# EAGLE design rpi-can-rs485 (EAGLE 6.5.0)
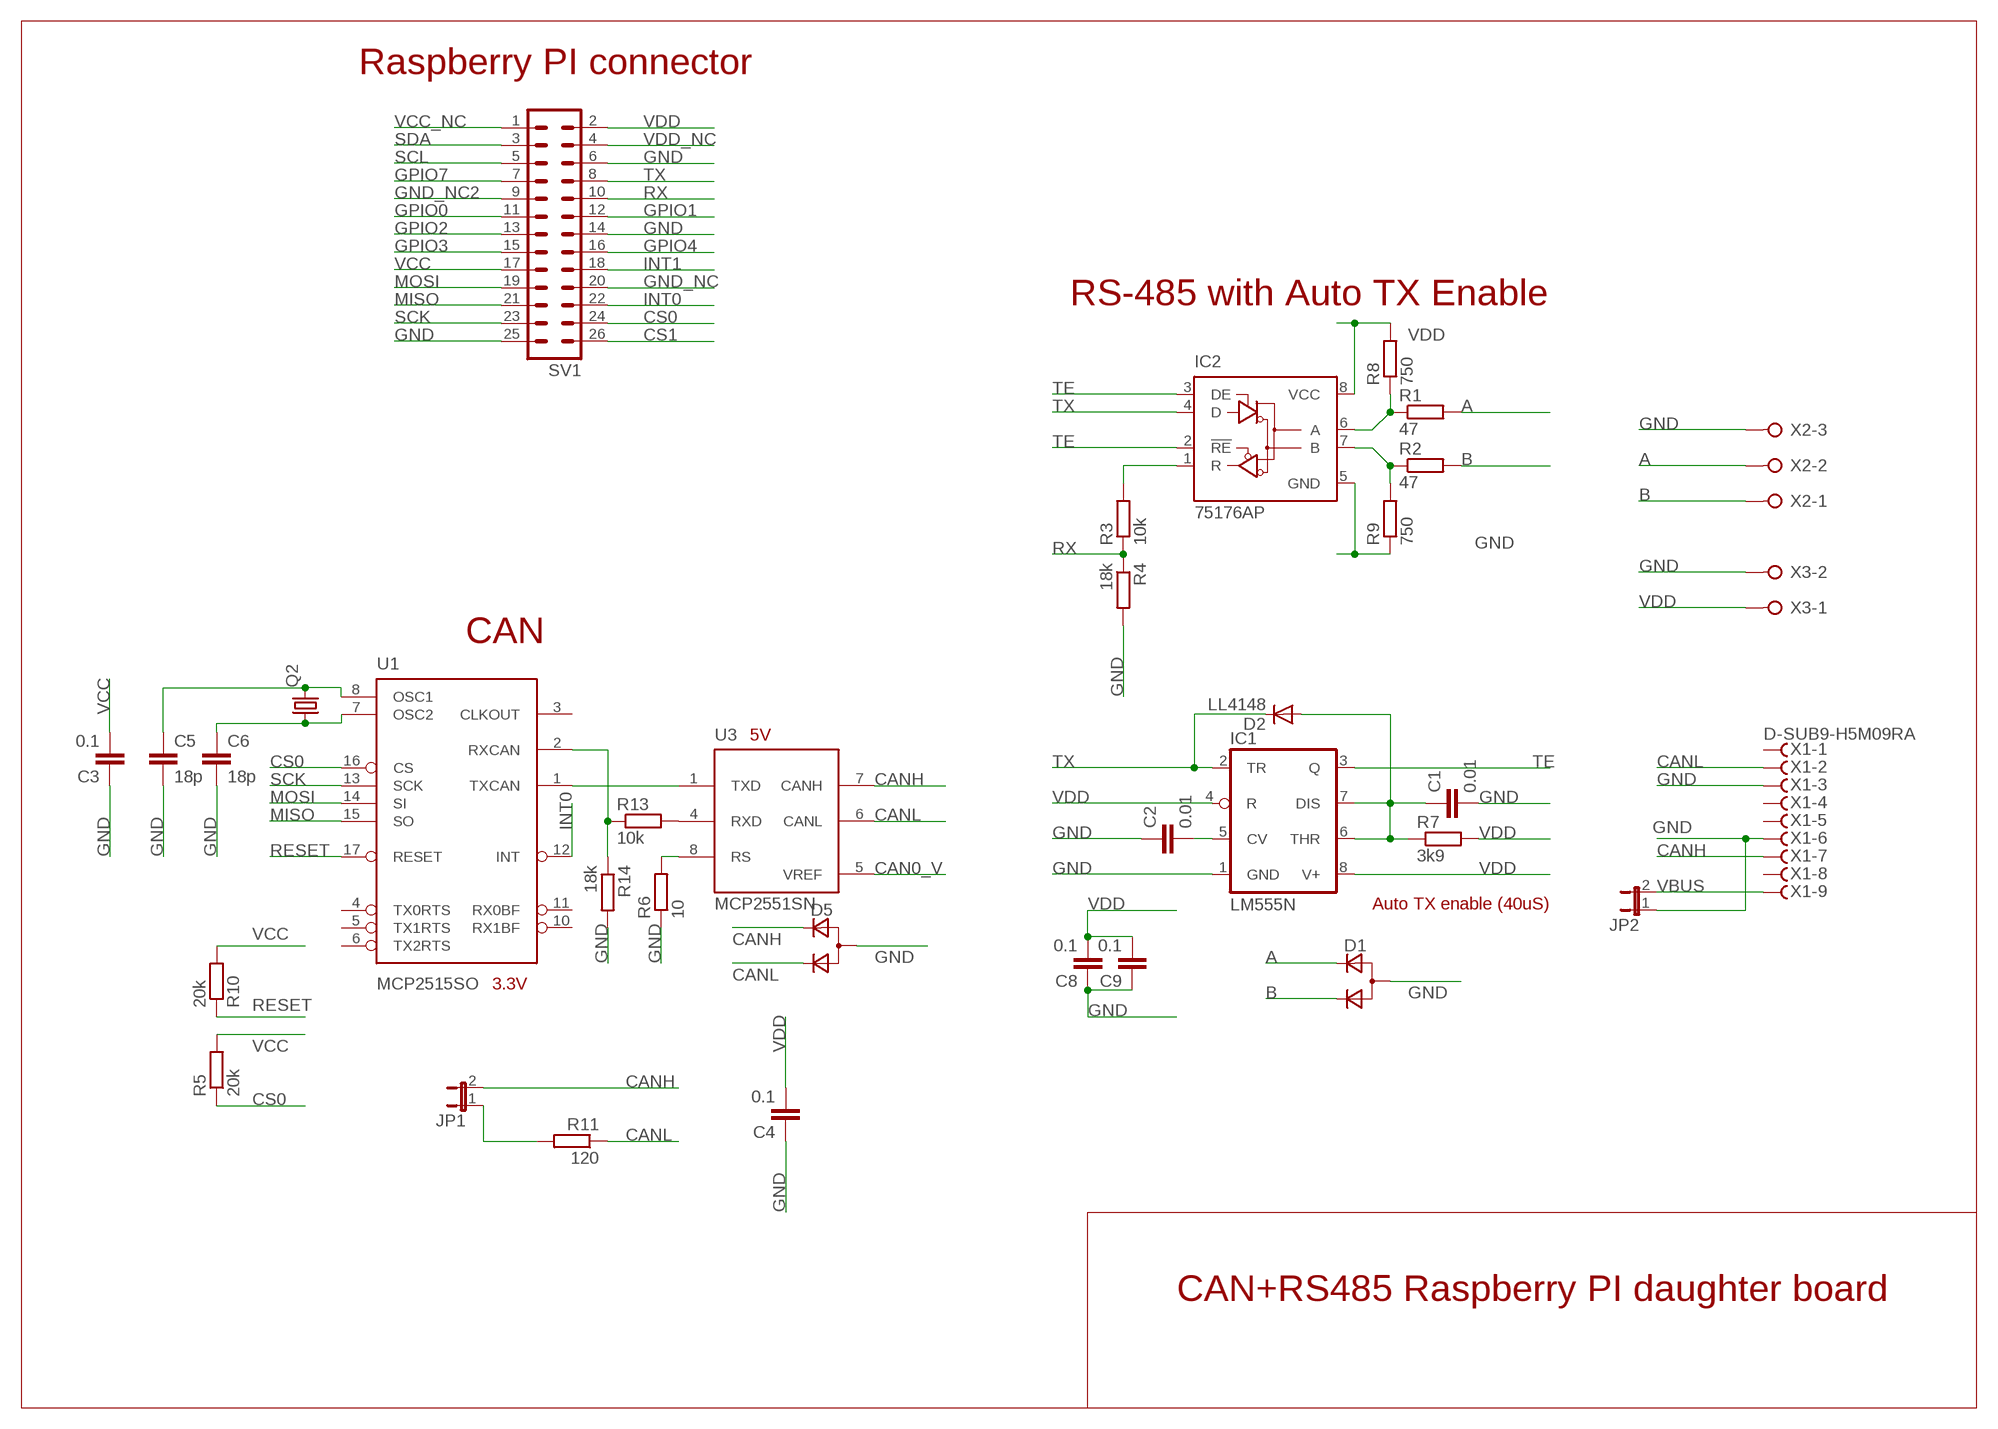
[diagram p0: schematic, sheet 1]

## Parts
C1  0.01  C-EUC0805  [C0805]
C2  0.01  C-EUC0805  [C0805]
C3  0.1  C-EUC0805  [C0805]
C4  0.1  C-EUC0805  [C0805]
C5  18p  C-EUC0805  [C0805]
C6  18p  C-EUC0805  [C0805]
C8  0.1  C-EUC0805  [C0805]
C9  0.1  C-EUC0805  [C0805]
D1  D_2CSOT323  [SOT323]
D2  LL4148  DIODE-SOD80C  [SOD80C]
D5  D_2CSOT323  [SOT323]
IC1  LM555N  [DIL08]
IC2  75176AP  [DIL08]
JP1  JP1E  [JP1]
JP2  JP1E  [JP1]
Q2  CRYSTALHC49S  [HC49/S]
R1  47  R-EU_R1206  [R1206]
R2  47  R-EU_R1206  [R1206]
R3  10k  R-EU_R0805  [R0805]
R4  18k  R-EU_R0805  [R0805]
R5  20k  R-EU_R0603  [R0603]
R6  10  R-EU_R0805  [R0805]
R7  3k9  R-EU_R0805  [R0805]
R8  750  R-EU_R1206  [R1206]
R9  750  R-EU_R1206  [R1206]
R10  20k  R-EU_R0805  [R0805]
R11  120  R-EU_R0805  [R0805]
R13  10k  R-EU_R0805  [R0805]
R14  18k  R-EU_R0805  [R0805]
SV1  MA13-2  [MA13-2]
U1  MCP2515SO  MCP2510SO  [SO-18W]
U3  MCP2551SN  [SO-08]
X1  D-SUB9-H5M09RA  [H5M09RA]
X2  W237-03P  [W237-133]
X3  W237-02P  [W237-132]

## Nets
A: D1.2(C1) R1.2 X2.2
B: D1.3(C2) R2.2 X2.1
CAN0_TX: U1.1(TXCAN) U3.1(TXD)
CAN0_V: U3.5(VREF)
CANH: D5.2(C1) JP1.2 U3.7(CANH) X1.7
CANL: D5.3(C2) R11.1 U3.6(CANL) X1.2
CS0: R5.1 SV1.24 U1.16(CS)
CS1: SV1.26
GND: C1.2 C2.1 C3.1 C4.1 C5.2 C6.2 C8.1 C9.1 D1.1(A) D5.1(A) IC1.1(GND) IC2.5(GND) JP2.1 R4.2 R6.1 R9.1 R14.2 SV1.6 SV1.14 SV1.25 X1.3 X1.6 X2.3 X3.2
GND_NC: SV1.20
GND_NC2: SV1.9
GPIO0: SV1.11
GPIO1: SV1.12
GPIO2: SV1.13
GPIO3: SV1.15
GPIO4: SV1.16
GPIO7: SV1.7
INT0: SV1.22 U1.12(INT)
INT1: SV1.18
MISO: SV1.21 U1.15(SO)
MOSI: SV1.19 U1.14(SI)
N$1: C6.1 Q2.1 U1.7(OSC2)
N$2: C1.1 D2.A IC1.6(THR) IC1.7(DIS) R7.1
N$3: IC2.7(B) R2.1 R9.2
N$4: IC2.6(A) R1.1 R8.1
N$5: C2.2 IC1.5(CV)
N$6: C5.1 Q2.2 U1.8(OSC1)
N$7: R6.2 U3.8(RS)
N$8: IC2.1(R) R3.2
N$9: JP1.1 R11.2
N$10: R13.2 U3.4(RXD)
N$13: R13.1 R14.1 U1.2(RXCAN)
RESET: R10.1 U1.17(RESET)
RX: R3.1 R4.1 SV1.10
SCK: SV1.23 U1.13(SCK)
SCL: SV1.5
SDA: SV1.3
TE: IC1.3(Q) IC2.2(!RE) IC2.3(DE)
TX: D2.C IC1.2(TR) IC2.4(D) SV1.8
VBUS: JP2.2 X1.9
VCC: C3.2 R5.2 R10.2 SV1.17
VCC_NC: SV1.1
VDD: C4.2 C8.2 C9.2 IC1.4(R) IC1.8(V+) IC2.8(VCC) R7.2 R8.2 SV1.2 X3.1
VDD_NC: SV1.4
Unconnected: U1.3(CLKOUT) U1.4(TX0RTS) U1.5(TX1RTS) U1.6(TX2RTS) U1.10(RX1BF) U1.11(RX0BF) X1.1 X1.4 X1.5 X1.8

## Notes on the sheet
- Raspberry PI connector
- RS-485 with Auto TX Enable
- CAN
- 5V
- Auto TX enable (40uS)
- 3.3V
- CAN+RS485 Raspberry PI daughter board

## Power pins joined to a net without a drawn wire
GND: U1.9(VSS) U3.2(VSS)
VCC: U1.18(VDD)
VDD: U3.3(VDD)

## Library data of the parts
C1-C6 C8 C9 = rcl:C-EU: CAPACITOR, European symbol
D1 D5 = zetex:D_2C: Dual DIODE; OC_FARNELL: unknown; OC_NEWARK: unknown
D2 = diode:DIODE-: DIODE
IC1 = linear:*555: TIMER
IC2 = 751xx:75176A: DIFFERENTIAL BUS TRANSCEIVER Source: http://focus.ti.com/lit/ds/symlink/sn75176a.pdf
JP1 JP2 = jumper:JP1E: JUMPER
Q2 = crystal:CRYSTAL: CRYSTAL; OC_FARNELL: 1667008; OC_NEWARK: unknown
R1-R11 R13 R14 = rcl:R-EU_: RESISTOR, European symbol
SV1 = con-lstb:MA13-2: PIN HEADER; OC_FARNELL: unknown; OC_NEWARK: unknown
U1 = my-microchip-can:MCP2510
U3 = my-microchip-can:MCP2551: High Speed CAN tranceiver
X1 = con-thomas-betts:D-SUB9-: D-Subminiatur Connector Source: Electronioc Interconnects European Edition 1998; OC_FARNELL: unknown; OC_NEWARK: unknown
X2 = con-wago-508:W237-03P: WAGO SREW CLAMP; OC_FARNELL: unknown; OC_NEWARK: unknown
X3 = con-wago-508:W237-02P: WAGO SREW CLAMP; OC_FARNELL: unknown; OC_NEWARK: unknown

## Board
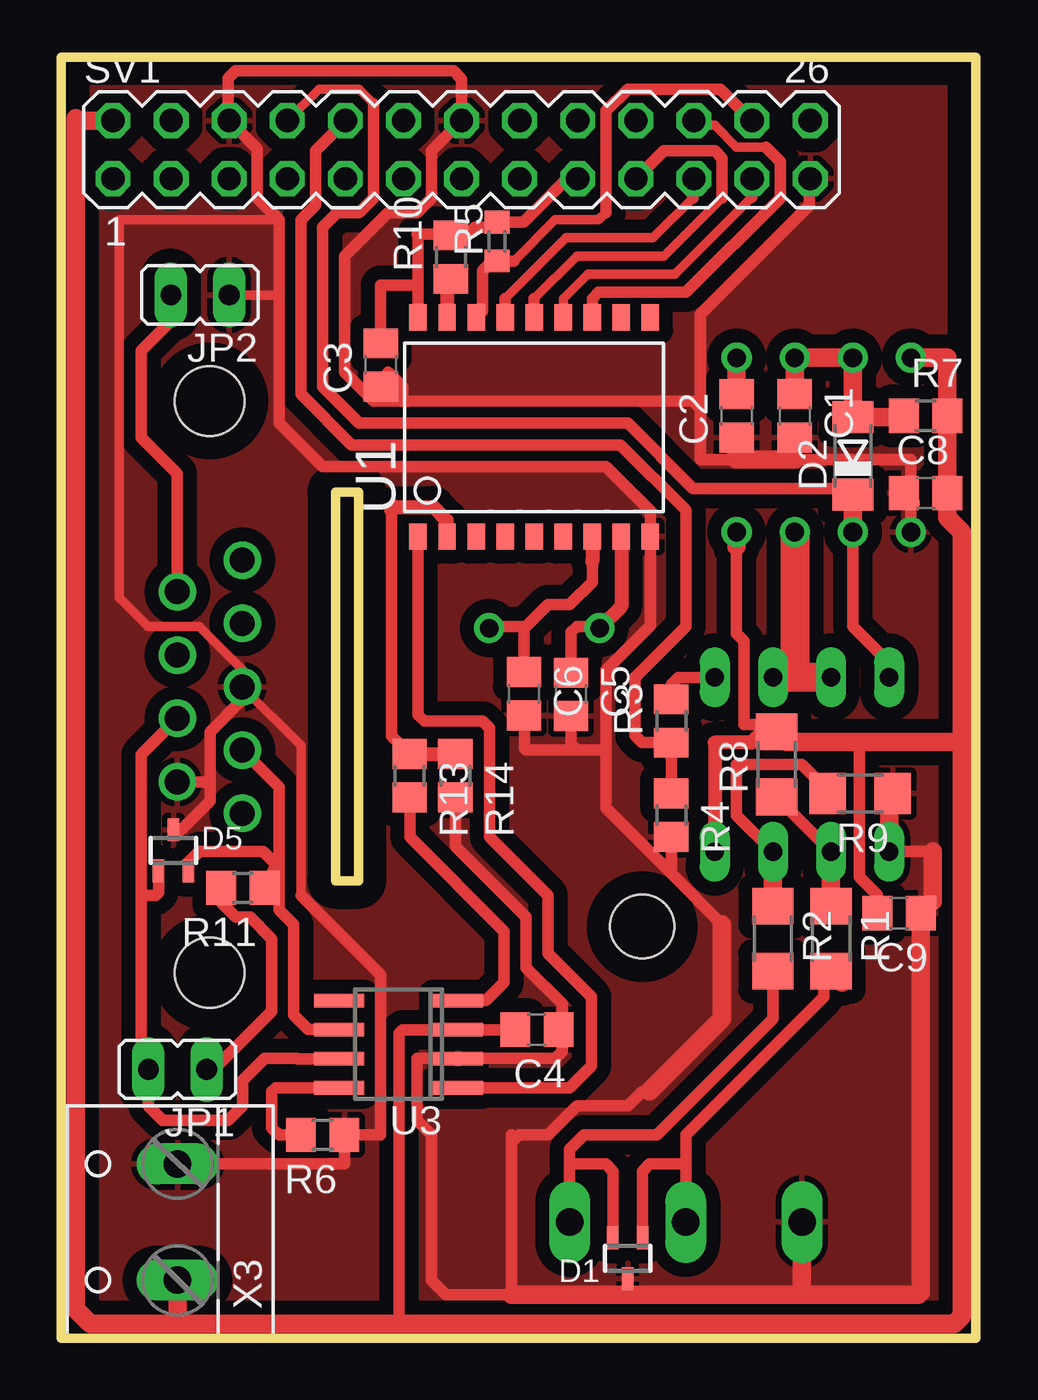
[diagram p1: board, top side]
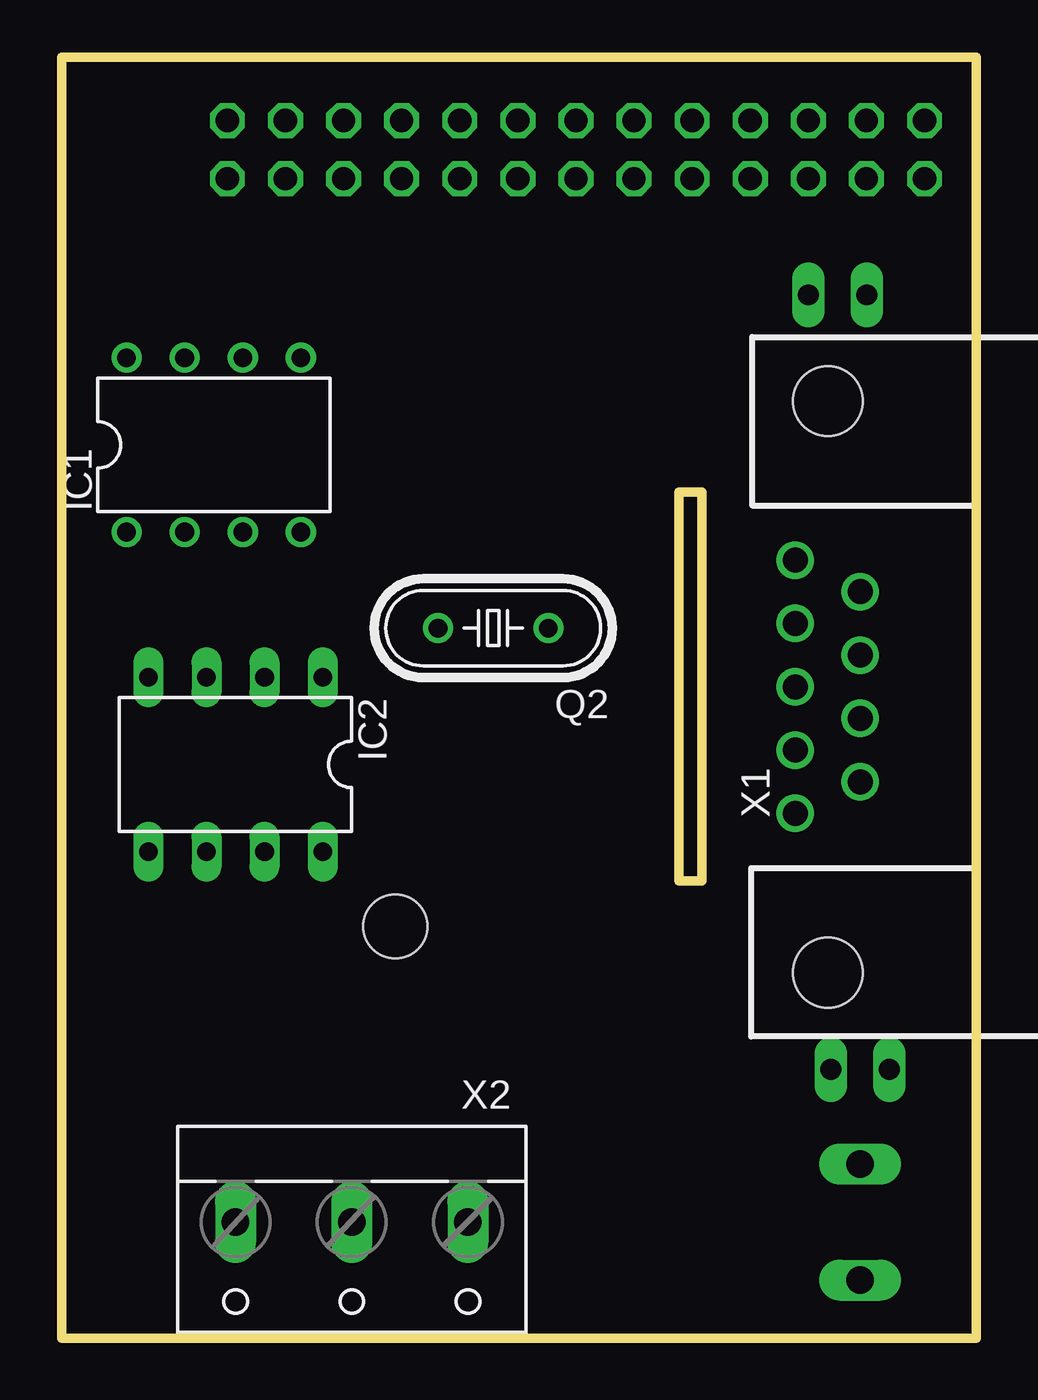
[diagram p2: board, bottom side, seen from below]

Size 40 x 56 mm. Coordinates in mm from the lower left corner, seen from the top.
Outline: 0,0 40,0 40,56 0,56 0,0
Outline: 12,20 13,20 13,37 12,37 12,20
Copper layers (1*16): Top 0.035mm / dielectric 1.5mm / Bottom 0.035mm
Design rules: minimum track width 10mil, minimum drill 24mil, track to track 8mil, track to pad 8mil, pad to pad 8mil, via to via 8mil, smd to smd 8mil, copper to edge 40mil, drill to drill 8mil, minimum pad ring 10mil, minimum via ring 8mil, stop-mask expansion 4mil, vias tented up to drill 0mil, thermal gap 10mil
Holes 2.8 mm at 25.4,18

### Footprints (pad centres in the part's own frame; a part is rotated, then mirrored left to right if it is on the bottom)
C0805 = smd 1.3 x 1.5: 1 -0.95,0; 2 0.95,0
SOT323 = smd 0.5 x 1: 1 0,0.9; 2 -0.65,-0.9; 3 0.65,-0.9
SOD80C = smd 1.4 x 1.8: A 1.7,0; C -1.7,0
DIL08 = drill 0.813 pad 1.27: 1 -3.81,-3.81; 2 -1.27,-3.81; 3 1.27,-3.81; 4 3.81,-3.81; 5 3.81,3.81; 6 1.27,3.81; 7 -1.27,3.81; 8 -3.81,3.81
DIL08' = drill 0.813 long: 1 -3.81,-3.81; 2 -1.27,-3.81; 3 1.27,-3.81; 4 3.81,-3.81; 5 3.81,3.81; 6 1.27,3.81; 7 -1.27,3.81; 8 -3.81,3.81
JP1 = drill 0.914 long: 1 0,-1.27; 2 0,1.27
HC49/S = drill 0.813: 1 -2.413,0; 2 2.413,0
R1206 = smd 1.6 x 1.803: 1 -1.422,0; 2 1.422,0
R0805 = smd 1.3 x 1.5: 1 -0.95,0; 2 0.95,0
R0603 = smd 1 x 1.1: 1 -0.85,0; 2 0.85,0
MA13-2 = drill 1.016 octagon: 1 -15.24,-1.27; 2 -15.24,1.27; 3 -12.7,-1.27; 4 -12.7,1.27; 5 -10.16,-1.27; 6 -10.16,1.27; 7 -7.62,-1.27; 8 -7.62,1.27; 9 -5.08,-1.27; 10 -5.08,1.27; 11 -2.54,-1.27; 12 -2.54,1.27; 13 0,-1.27; 14 0,1.27; 15 2.54,-1.27; 16 2.54,1.27; 17 5.08,-1.27; 18 5.08,1.27; 19 7.62,-1.27; 20 7.62,1.27; 21 10.16,-1.27; 22 10.16,1.27; 23 12.7,-1.27; 24 12.7,1.27; 25 15.24,-1.27; 26 15.24,1.27
SO-18W = smd 0.762 x 1.143: 1 -5.08,-4.788; 2 -3.81,-4.788; 3 -2.54,-4.788; 4 -1.27,-4.788; 5 0,-4.788; 6 1.27,-4.788; 7 2.54,-4.788; 8 3.81,-4.788; 9 5.08,-4.788; 10 5.08,4.788; 11 3.81,4.788; 12 2.54,4.788; 13 1.27,4.788; 14 0,4.788; 15 -1.27,4.788; 16 -2.54,4.788; 17 -3.81,4.788; 18 -5.08,4.788
SO-08 = smd 0.6 x 2.2: 1 -1.905,-2.6; 2 -0.635,-2.6; 3 0.635,-2.6; 4 1.905,-2.6; 5 1.905,2.6; 6 0.635,2.6; 7 -0.635,2.6; 8 -1.905,2.6
H5M09RA = drill 1.092: 1 -5.537,1.422; 2 -2.769,1.422; 3 0,1.422; 4 2.769,1.422; 5 5.537,1.422; 6 -4.153,-1.422; 7 -1.384,-1.422; 8 1.384,-1.422; 9 4.153,-1.422 | hole 3.048: -12.497,0; 12.497,0
W237-133 = drill 1.194 long: 1 -5.08,-0.635; 2 0,-0.635; 3 5.08,-0.635
W237-132 = drill 1.194 long: 1 -2.54,-0.635; 2 2.54,-0.635

### Placement (x,y rotation side)
C1  32.08,40.32 270 top
C2  29.53,40.32 90 top
C3  13.98,42.55 90 top
C4  20.8,13.49 180 top
C5  22.3,28.15 270 top
C6  20.24,28.17 270 top
C8  37.79,36.94 0 top
C9  36.63,18.58 180 top
D1  24.77,3.49 180 top
D2  34.61,38.58 90 top
D5  4.91,21.33 0 top
IC1  33.34,39.05 0 bottom
IC2  75176AP  [DIL08']  32.39,25.08 180 bottom
JP1  5.09,11.75 90 top
JP2  6.07,45.61 90 top
Q2  21.13,31.04 180 bottom
R1  33.66,17.46 270 top
R2  31.12,17.46 270 top
R3  26.68,26.99 90 top
R4  26.68,22.86 270 top
R5  19.06,47.94 90 top
R6  11.44,8.89 180 top
R7  37.79,40.32 0 top
R8  31.28,25.08 90 top
R9  34.93,23.81 180 top
R10  17.04,47.26 90 top
R11  7.94,19.68 180 top
R13  15.23,24.59 270 top
R14  17.24,24.59 270 top
SV1  17.51,51.96 0 top
U1  20.69,39.84 0 top
U3  14.75,12.86 90 top
X1  6.5,28.48 90 bottom
X2  27.31,4.45 180 bottom
X3  4.45,5.08 90 top

### Tracks (layer width: path | path; a pad name or v marks a point on that pad's centre or on a via)
A
  Top 0.508: X2.2 27.31,7.62 | 27.31,7.62 27.31,8.89 33.34,14.92 33.34,15.72 R1.2 | D1.2 25.41,4.41 25.41,7.3 25.72,7.62 27.31,7.62
  Top 0.813: R1.2 34.14,15.56
B
  Top 0.508: R2.2 31.12,13.97 26.04,8.89 22.87,8.89 22.23,8.26 22.23,7.62 | D1.3 24.14,4.41 24.14,7.3 23.82,7.62 22.23,7.62 | 22.23,7.62 X2.1
CAN0_TX
  Top 0.508: U1.1 15.62,27.25 15.88,26.99 18.42,26.99 18.74,26.67 18.74,21.91 21.28,19.37 21.28,16.83 23.19,14.92 23.19,11.91 22.23,10.95 U3.1
  Top 0.61: U1.1
CANH
  Top 0.508: 3.5,19.37 3.5,25.52 X1.7 | 3.5,19.37 3.5,12.06 JP1.2 3.82,10.16 4.45,9.53 7.31,9.53 7.94,10.16 7.94,11.27 8.9,12.22 10.32,12.22 U3.7 | D5.2 4.26,19.5 4.14,19.37 3.5,19.37
CANL
  Top 0.508: X1.2 9.53,24.1 9.53,20.96 | 9.53,20.96 9.4,20.7 | 9.4,20.7 R11.1 | 9.53,20.96 9.53,18.73 10.17,18.1 10.17,14.13 10.8,13.49 U3.6 | D5.3 5.56,20.8 6.04,21.27 8.83,21.27 9.4,20.7
CS0
  Top 0.406: 23.82,49.21 23.5,48.9 21.6,48.9 19.8,47.09
  Top 0.508: SV1.24 28.83,54.61 24.77,54.61 23.82,53.66 23.82,49.21 | U1.16 18.42,44.9 18.42,46.67 18.84,47.09 R5.1 19.8,47.09
  Top 0.61: 18.11,44.66 U1.16
GND
  Top 0.406: 10.48,19.37 10.48,25.92 X1.3 7.92,29.23 6.04,31.11 3.82,31.11 2.55,32.38 2.55,48.9 9.53,48.9 | JP2.1 9.53,45.61 9.53,45.72
  Top 0.508: IC1.1 37.16,36.51 37.16,38.42 32.08,38.42 C1.2 | 29.53,38.42 27.95,38.42 27.95,40.64 | 14.93,40.96 13.66,40.96 12.39,42.23 12.39,47.31 14.3,49.21 15.56,49.21 16.2,49.85 16.2,51.92 SV1.14 17.51,55.05 17.15,55.4 7.63,55.4 7.31,55.09 7.31,53.27 SV1.6 8.58,52 8.58,49.85 9.53,48.9 9.53,45.72 9.53,40.01 11.44,38.1 23.82,38.1 25.77,36.16 U1.9 25.77,31.16 23.82,29.21 23.82,25.72 | IC2.5 38.11,21.27 | 37.58,2.02 37.47,1.91 | 32.39,2.22 32.08,1.91 | R14.2 17.24,21.5 20.33,18.41 20.33,16.19 21.92,14.61 21.92,13.65 C4.1 21.91,13.34 21.92,13.34 21.92,12.54 21.6,12.22 U3.2 | 22.41,27.3 C5.2 22.3,25.97 22.55,25.72 | C6.2 20.26,27.2 20.26,25.78 20.33,25.72 22.55,25.72 | 23.82,25.72 23.82,23.18 26.68,20.32 | 26.68,20.32 28.9,18.1 | R4.2 26.68,20.32 | C3.1 14.29,42.23 14.93,41.59 14.93,40.96 | 27.95,40.64 27.95,44.77 32.71,49.53 32.71,50.65 SV1.25 | 14.93,40.96 27.63,40.96 27.95,40.64 | 19.69,8.89 19.69,8.57 | 19.69,8.57 19.69,1.91 16.83,1.91 16.2,2.54 16.2,8.89 15.56,9.53 15.56,12.22 U3.2 | 22.55,25.72 23.82,25.72 | 38.11,19.1 C9.1 | D1.1 24.77,1.91 | 25.72,10.79 25.41,10.79 24.77,10.16 22.55,10.16 21.28,8.89 20.01,8.89 19.69,8.57 | 10.48,19.37 13.98,15.88 13.98,8.89 R6.1 12.39,7.62 X3.2 | U3.2 | D5.1 5.25,22.23 6.52,23.5 6.52,24.13 | 6.52,24.13 6.52,26.51 7.94,27.94 7.94,28.46 X1.3 | X1.6 6.32,24.32 6.52,24.13
  Top 0.813: IC2.5 36.2,23.66 R9.1 | 38.11,19.1 38.11,21.27 | 32.08,38.42 29.53,38.42 C2.1 | 36.84,36.83 37.16,36.51 | C9.1 37.58,2.02 | 37.47,1.91 32.08,1.91 24.77,1.91 19.69,1.91 | X2.3 32.39,2.22 | 25.72,10.79 28.9,13.97 28.9,18.1
  pour Top (isolate 0.61): 0.01,0 40.01,0 40.01,55.88 0.01,55.88
INT0
  Top 0.406: 30.81,52.07 29.53,52.07 28.58,53.02 27.88,53.02 SV1.22
  Top 0.508: 30.81,52.07 31.44,51.44 31.44,49.85 27.31,45.72 23.5,45.72 23.22,45.44 U1.12
MISO
  Top 0.406: 19.42,45.44 22.07,48.1 25.88,48.1 27.63,49.85
  Top 0.508: U1.15 19.42,45.44 | 27.63,49.85 27.63,50.65 SV1.21
MOSI
  Top 0.406: 28.9,49.85 26.36,47.31 22.55,47.31 20.69,45.44
  Top 0.508: SV1.19 26.35,51.91 28.58,51.91 28.9,51.59 28.9,49.85 | U1.14 20.69,45.44
N$1
  Top 0.508: C6.1 20.24,31.03 20.33,31.11 | 20.33,31.11 18.79,31.11 Q2.1 | 23.22,33.96 23.22,33.06 22.23,32.07 21.28,32.07 20.33,31.11
  Top 0.61: U1.7 23.22,33.96
N$2
  Top 0.813: C1.1 IC1.6 IC1.7 D2.A 36.79,40.28 R7.1
N$3
  Top 0.508: 33.51,23.96 32.39,25.08 29.53,25.08 29.53,22.86 IC2.7
  Top 0.813: R9.2 33.51,23.96 | IC2.7 R2.1
N$4
  Top 0.508: R8.1 IC2.6
  Top 0.813: R8.1 | IC2.6 R1.1
N$5
  Top 0.813: C2.2 IC1.5
N$6
  Top 0.508: C5.1 22.3,30.86 22.55,31.11 23.47,31.11 Q2.2
  Top 0.61: U1.8 24.5,31.99 Q2.2
N$7
  Top 0.508: U3.8 9.37,10.95 9.22,10.79 9.22,9.21 9.53,8.89 R6.2
N$8
  Top 0.508: IC2.1 27,28.89 26.68,28.57 R3.2
N$9
  Top 0.508: R11.2 7,19.05 7.63,18.41 8.26,18.41 9.22,17.46 9.22,14.29 6.67,11.75 JP1.1
N$10
  Top 0.508: U3.4 18.58,14.76 19.38,15.56 19.38,17.78 15.25,21.91 15.25,23.62 R13.2
  Top 0.61: R13.2 15.09,23.5
N$13
  Top 0.508: 14.45,36.19 14.45,26.32 R13.1
  Top 0.61: 14.45,36.19 14.6,36.34 16.28,36.34 16.86,35.75 16.86,35.06 U1.2 | R13.1 R14.1
RESET
  Top 0.61: R10.1 16.88,45.93 U1.17
RX
  Top 0.508: SV1.10 11.12,51.92 11.12,49.53 10.48,48.9 10.48,41.27 12.71,39.05 24.45,39.05 27.31,36.2 27.31,31.11 25.09,28.89 25.09,26.35 25.41,26.04 R3.1 R4.1
SCK
  Top 0.406: U1.13 21.95,45.44 23.03,46.51 26.84,46.51 30.21,49.89 | 30.17,50.65 SV1.23
  Top 0.508: 30.21,49.89 SV1.23
TE
  Top 1.27: IC2.3 32.08,28.89 | 32.08,28.89 IC2.2 | IC1.3 32.08,28.89
TX
  Top 0.406: 13.66,53.98 13.03,54.61 11.27,54.61 SV1.8
  Top 0.508: 34.41,37.15 27.63,37.15 24.77,40.01 13.03,40.01 11.44,41.59 11.44,48.58 12.07,49.21 13.03,49.21 13.66,49.85 13.66,53.98 | IC2.4 36.2,29.53 34.61,31.11 IC1.2
  Top 0.813: 34.41,37.15 D2.C IC1.2
VBUS
  Top 0.508: X1.9 5.08,37.79 3.5,39.37 3.5,43.18 4.77,44.45 4.77,45.64 | 4.77,45.72 4.77,45.64 | 4.77,45.64 JP2.2
VCC
  Top 0.508: 15.56,44.59 U1.18 15.61,46.04 | 15.61,46.04 15.61,48.22 15.56,48.26 16.99,48.26 R10.2 | 17.09,48.26 R10.2 | C3.2 13.98,46.04 15.61,46.04 | R10.2 17.73,48.21 18.11,48.58 18.84,48.58 R5.2 20.22,48.79 22.12,50.69 SV1.17
VDD
  Top 0.508: C9.2 35.68,19.38 34.91,20.16 34.91,26.06 | 31.72,26.06 R8.2 30.96,26.82 29.85,26.82 29.85,30.48 29.53,30.8 29.53,34.61 | C4.2 U3.3 14.93,13.49 14.77,13.34 14.77,0.79 14.61,0.64 | 39.35,26.06 39.38,26.04
  Top 0.61: 31.43,26.35 30.49,26.35 30.17,26.04 28.58,26.04 IC2.8
  Top 0.813: R8.2 31.43,26.35 | IC1.8 38.74,42.86 R7.2 C8.2 38.74,35.88 39.38,35.24 39.38,26.04 39.38,0.95 39.06,0.64 14.61,0.64 5.09,0.64 | IC1.4 29.53,34.61 | 5.09,0.64 1.28,0.64 0.64,1.27 0.64,53.34 0.75,53.23 SV1.2 | 39.35,26.06 34.91,26.06 31.72,26.06 | X3.1 5.09,0.64